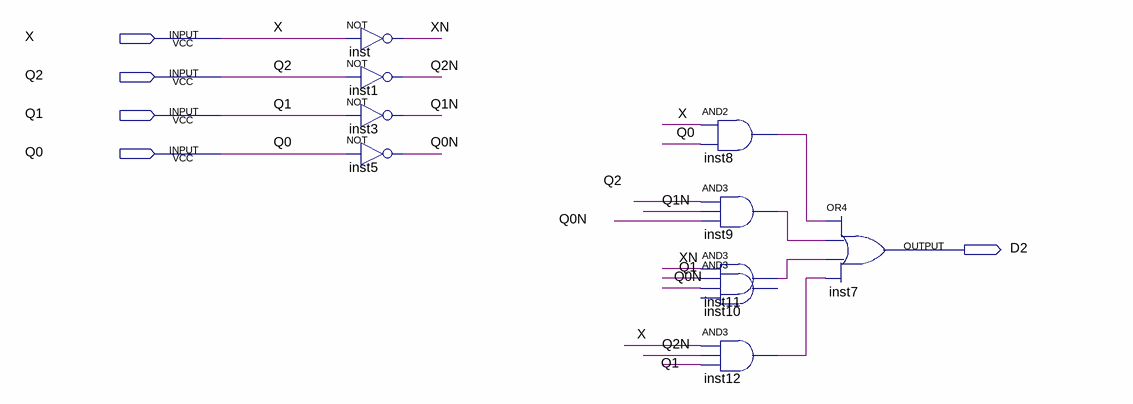
[diagram p0: schematic sheet]
// Quartus schematic D2.bdf as structural Verilog: 10 symbols, 5 pins
module D2 (
  input  X,
  input  Q2,
  input  Q1,
  input  Q0,
  output D2
);

  wire inst8_out, inst9_out, inst11_out, inst12_out, Q0N, Q1N, Q2N, XN;

  not inst (XN, X);
  not inst1 (Q2N, Q2);
  not inst3 (Q1N, Q1);
  not inst5 (Q0N, Q0);
  and inst8 (inst8_out, X, Q0);
  and inst9 (inst9_out, Q2, Q1N, Q0N);
  and inst11 (inst11_out, XN, Q1, Q0N);
  // AND3 inst10 has open pins: IN1=Q1, IN2=Q0N, IN3=open, OUT=open
  and inst12 (inst12_out, X, Q2N, Q1);
  or inst7 (D2, inst8_out, inst9_out, inst11_out, inst12_out);
endmodule
